# EAGLE schematic rev01 (EAGLE 6.5.0)
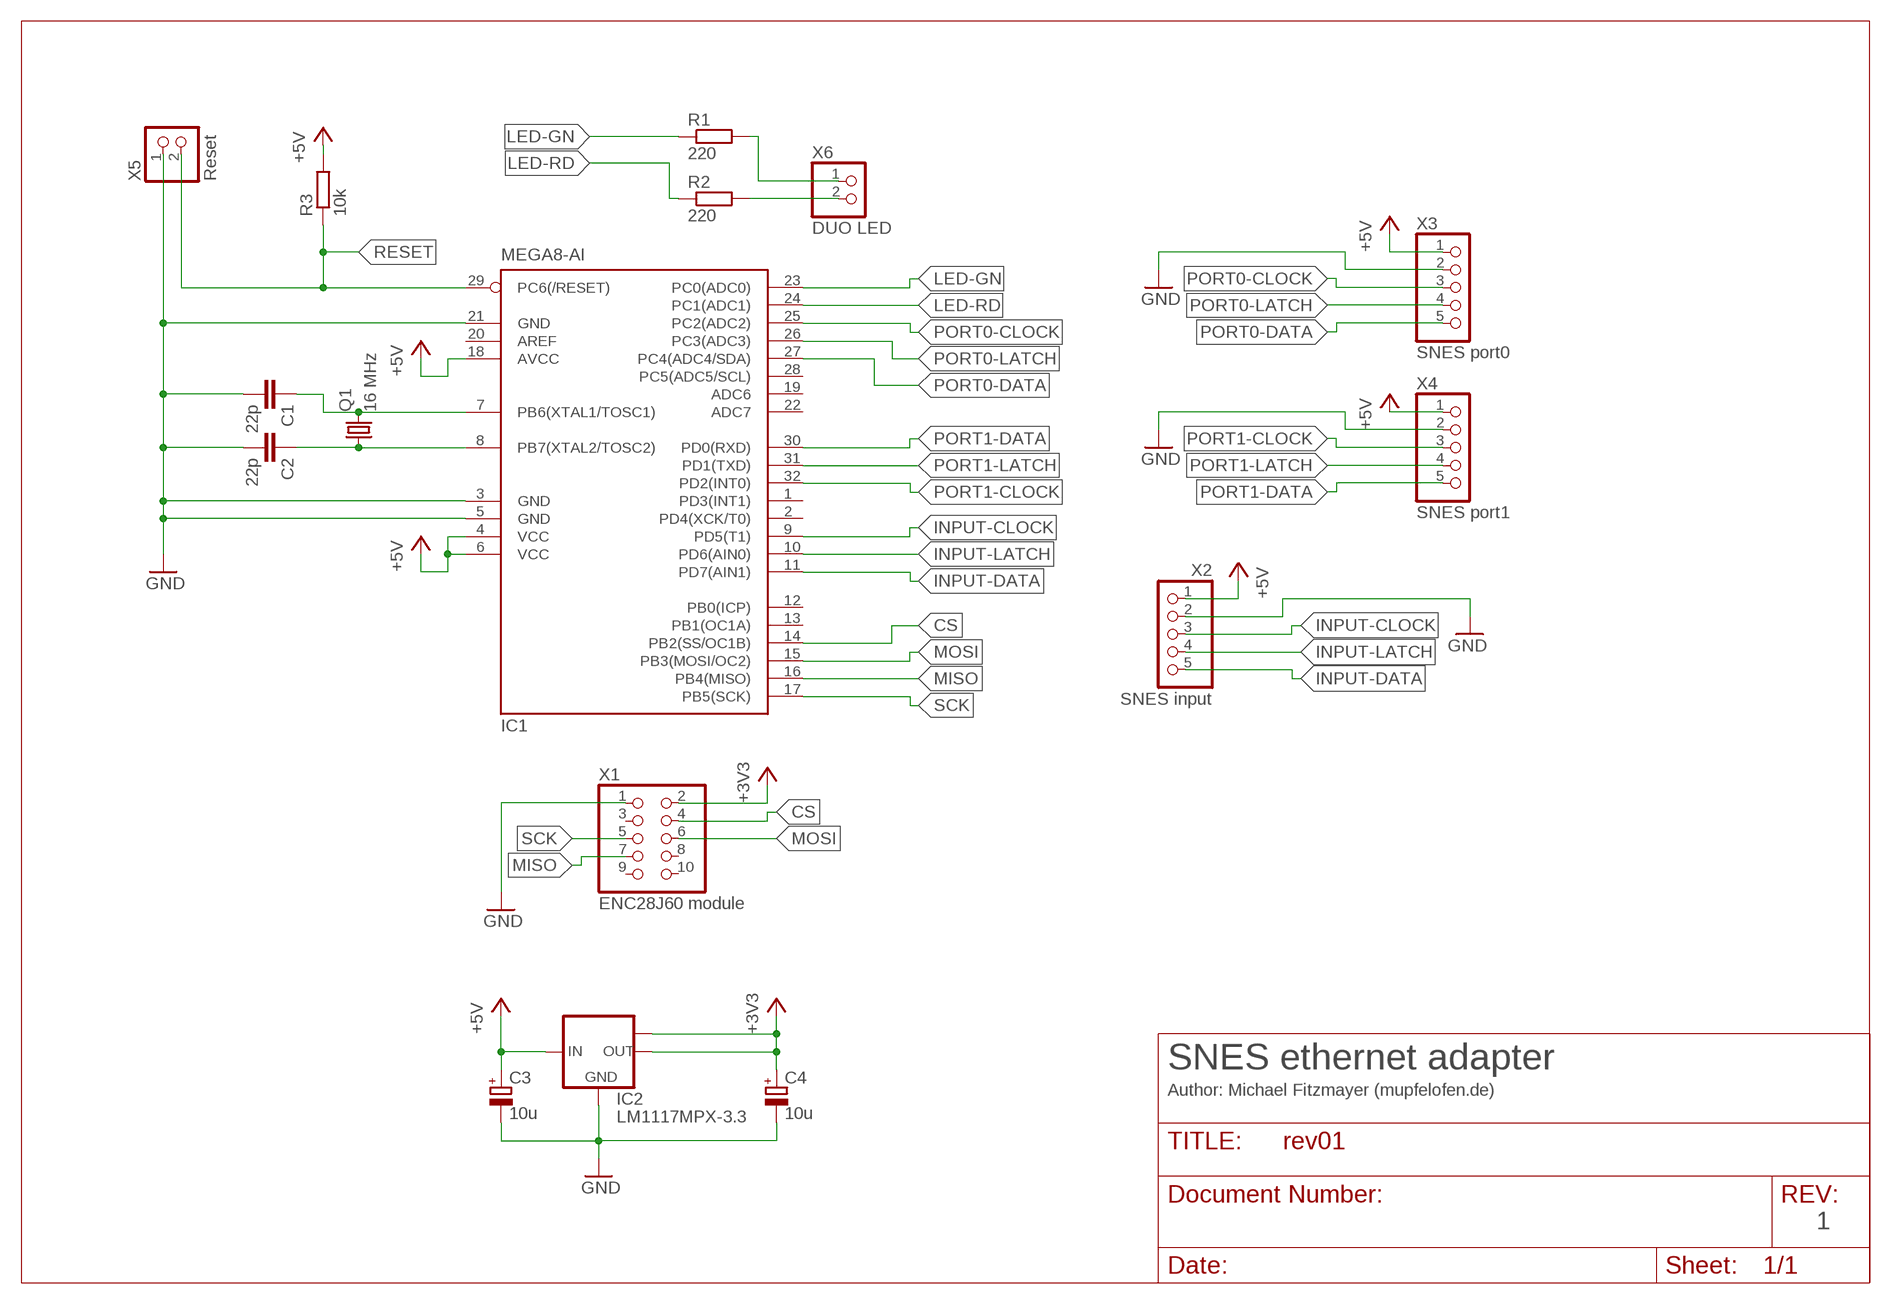
[diagram p0: schematic, sheet 1]

## Parts
C1  22p  C-EUC1206  [C1206]
C2  22p  C-EUC1206  [C1206]
C3  10u  CPOL-EUC/6032-28R  [C/6032-28R]
C4  10u  CPOL-EUC/6032-28R  [C/6032-28R]
IC1  MEGA8-AI  [TQFP32-08]
IC2  LM1117MPX-3.3  [SOT223]
Q1  16 MHz  CRYSTALSM49  [SM49]
R1  220  R-EU_R1206  [R1206]
R2  220  R-EU_R1206  [R1206]
R3  10k  R-EU_R1206  [R1206]
X1  ENC28J60 module  PINHD-2X5_2.54-SMD  [2X05SMD]
X2  SNES input  PINHD-1X5_2.54-SMD  [1X05SMD]
X3  SNES port0  PINHD-1X5_2.54-SMD  [1X05SMD]
X4  SNES port1  PINHD-1X5_2.54-SMD  [1X05SMD]
X5  Reset  PINHD-1X2_2.54-SMD  [1X02SMD]
X6  DUO LED  PINHD-1X2_2.54-SMD  [1X02SMD]

## Nets
+3V3: C4.+ IC2.2(OUT) IC2.TAB(OUT1) X1.2
+5V: C3.+ IC1.4(VCC) IC1.6(VCC) IC1.18(AVCC) IC2.3(IN) R3.2 X2.1 X3.1 X4.1
CS: IC1.14(PB2(SS/OC1B)) X1.4
GND: C1.2 C2.2 C3.- C4.- IC1.3(GND) IC1.5(GND) IC1.21(GND) IC2.1(GND) X1.1 X2.2 X3.2 X4.2 X5.1
INPUT-CLOCK: IC1.9(PD5(T1)) X2.3
INPUT-DATA: IC1.11(PD7(AIN1)) X2.5
INPUT-LATCH: IC1.10(PD6(AIN0)) X2.4
LED-GN: IC1.23(PC0(ADC0)) R1.1
LED-RD: IC1.24(PC1(ADC1)) R2.1
MISO: IC1.16(PB4(MISO)) X1.7
MOSI: IC1.15(PB3(MOSI/OC2)) X1.6
N$1: R2.2 X6.2
N$2: R1.2 X6.1
N$4: C1.1 IC1.7(PB6(XTAL1/TOSC1)) Q1.2
N$5: C2.1 IC1.8(PB7(XTAL2/TOSC2)) Q1.1
PORT0-CLOCK: IC1.25(PC2(ADC2)) X3.3
PORT0-DATA: IC1.27(PC4(ADC4/SDA)) X3.5
PORT0-LATCH: IC1.26(PC3(ADC3)) X3.4
PORT1-CLOCK: IC1.32(PD2(INT0)) X4.3
PORT1-DATA: IC1.30(PD0(RXD)) X4.5
PORT1-LATCH: IC1.31(PD1(TXD)) X4.4
RESET: IC1.29(PC6(/RESET)) R3.1 X5.2
SCK: IC1.17(PB5(SCK)) X1.5
Unconnected: IC1.1(PD3(INT1)) IC1.2(PD4(XCK/T0)) IC1.12(PB0(ICP)) IC1.13(PB1(OC1A)) IC1.19(ADC6) IC1.20(AREF) IC1.22(ADC7) IC1.28(PC5(ADC5/SCL)) X1.3 X1.8 X1.9 X1.10

## Notes on the sheet
- SNES ethernet adapter
- Author: Michael Fitzmayer (mupfelofen.de)
- 1

## Library data of the parts
C1 C2 = resistor:C-EU: CAPACITOR, European symbol
C3 C4 = resistor:CPOL-EU: POLARIZED CAPACITOR, European symbol
IC1 = atmel:MEGA8: MICROCONTROLLER 8 Kbytes FLASH, 1 kbytes SRAM, 512 bytes EEPROM, USART, 6-channel 10 bit ADC, 2-channel 8 bit ADC Pin compatible with Atmega48, ATMega88, ATMega168 Source: avr.lbr; MPN: ATMEGA8-16AU; OC_FARNELL: 9171371; OC_NEWARK: 73M8863
IC2 = lm1117:LM1117MPX-*
Q1 = crystal:CRYSTAL: CRYSTAL; OC_FARNELL: unknown; OC_NEWARK: unknown
R1-R3 = resistor:R-EU_: RESISTOR, European symbol
X1 = pinhead:PINHD-2X5: PIN HEADER
X2-X4 = pinhead:PINHD-1X5: PIN HEADER
X5 X6 = pinhead:PINHD-1X2: PIN HEADER